# Altium schematic sheet Flash.SchDoc
size A4; SheetNumber: 8; SheetTotal: 11
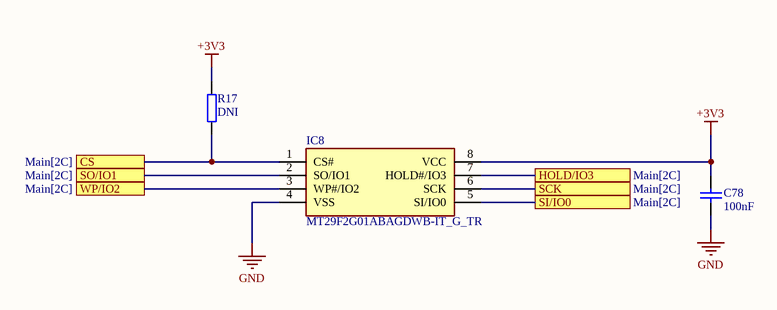
[diagram p0: Flash.SchDoc]

## Parts
C78  value 100nF  [CAP0402]  (hidden comment: Cap0402)
IC8  MT29F2G01ABAGDWB-IT_G_TR  [SON127P800X600X65-8N]
R17  value DNI  [RES0402]  (hidden comment: Res0402)

## Ports
CS (see Main[2C]), HOLD/IO3 (see Main[2C]), SCK (see Main[2C]), SI/IO0 (see Main[2C]), SO/IO1 (see Main[2C]), WP/IO2 (see Main[2C])

## Nets
+3V3: C78.2 IC8.8(VCC) R17.2
GND: C78.1 IC8.4(VSS)
CS: IC8.1(CS#) R17.1 ; port CS
HOLD/IO3: IC8.7(HOLD#/IO3) ; port HOLD/IO3
SCK: IC8.6(SCK) ; port SCK
SI/IO0: IC8.5(SI/IO0) ; port SI/IO0
SO/IO1: IC8.2(SO/IO1) ; port SO/IO1
WP/IO2: IC8.3(WP#/IO2) ; port WP/IO2

## Library data of the parts
C78 = Cap0402: Voltage: 50V
IC8 = MT29F2G01ABAGDWB-IT_G_TR: Integrated Circuit; Manufacturer_Name: Micron; Manufacturer_Part_Number: MT29F2G01ABAGDWB-IT:G TR; Datasheet Link: https://www.arrow.com/en/products/mt29f2g01abagdwb-itgtr/micron-technology; Height: 0.65mm; Mouser Part Number: 340-319922-REEL; Mouser Price/Stock: https://www.mouser.co.uk/ProductDetail/Micron/MT29F2G01ABAGDWB-ITG-TR?qs=j%252B1pi9TdxUa99FyONPZPSg%3D%3D; Arrow Part Number: MT29F2G01ABAGDWB-IT:G TR; Arrow Price/Stock: https://www.arrow.com/en/products/mt29f2g01abagdwb-itg-tr/micron-technology?region=nac